# EAGLE design noch10.rev2 (EAGLE 5.10)
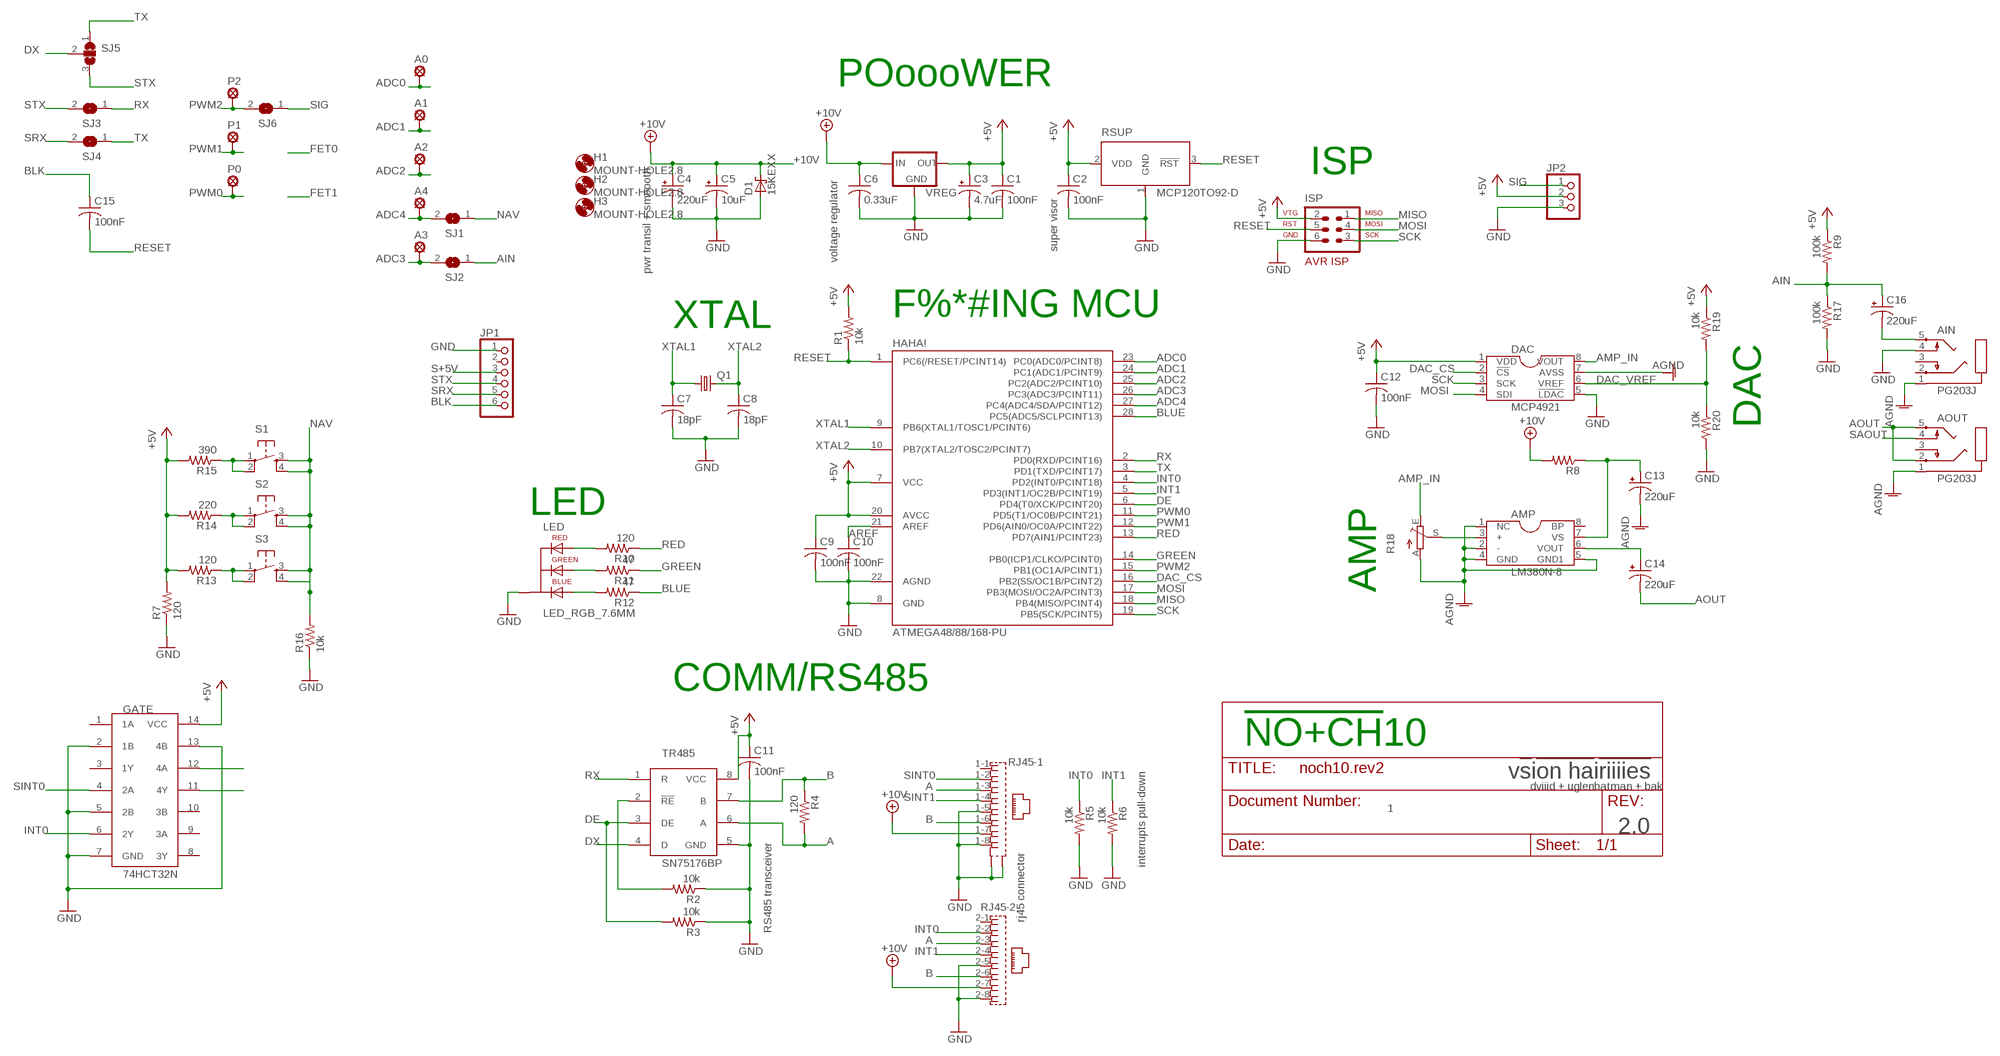
[diagram p0: schematic, sheet 1]

## Parts
A0  MCS10B  [MCS10B]
A1  MCS10B  [MCS10B]
A2  MCS10B  [MCS10B]
A3  MCS10B  [MCS10B]
A4  MCS10B  [MCS10B]
AIN  PG203J  [PG203J]
AMP  LM380N-8  [DIL08]
AOUT  PG203J  [PG203J]
C1  100nF  C-US025-025X050  [C025-025X050]
C2  100nF  C-US025-025X050  [C025-025X050]
C3  4.7uF  CPOL-USE2.5-5  [E2,5-5]
C4  220uF  CPOL-USE2.5-6  [E2,5-6]
C5  10uF  CPOL-USE2.5-5  [E2,5-5]
C6  0.33uF  C-US025-025X050  [C025-025X050]
C7  18pF  C-US025-025X050  [C025-025X050]
C8  18pF  C-US025-025X050  [C025-025X050]
C9  100nF  C-US025-025X050  [C025-025X050]
C10  100nF  C-US025-025X050  [C025-025X050]
C11  100nF  C-US025-025X050  [C025-025X050]
C12  100nF  C-US025-025X050  [C025-025X050]
C13  220uF  CPOL-USE2.5-6  [E2,5-6]
C14  220uF  CPOL-USE2.5-6  [E2,5-6]
C15  100nF  C-US025-025X050  [C025-025X050]
C16  220uF  CPOL-USE2.5-6  [E2,5-6]
D1  15KEXX  [CB429-17]
DAC  MCP4921  [DIL08]
GATE  74HCT32N  [DIL14]
H1  MOUNT-HOLE2.8  [2,8]
H2  MOUNT-HOLE2.8  [2,8]
H3  MOUNT-HOLE2.8  [2,8]
HAHA!  ATMEGA48/88/168-PU  [DIL28-3]
ISP  AVR-ISP-6  [AVR-ISP-6]
JP1  PINHD-1X6  [1X06]
JP2  PINHD-1X3  [1X03]
LED  LED_RGB_7.6MM  [LED_TH_7.6MM]
P0  MCS10B  [MCS10B]
P1  MCS10B  [MCS10B]
P2  MCS10B  [MCS10B]
Q1  CRYSTALHC49S  [HC49/S]
R1  10k  R-US_0204/7  [0204/7]
R2  10k  R-US_0204/7  [0204/7]
R3  10k  R-US_0204/7  [0204/7]
R4  120  R-US_0204/7  [0204/7]
R5  10k  R-US_0204/7  [0204/7]
R6  10k  R-US_0204/7  [0204/7]
R7  120  R-US_0204/7  [0204/7]
R8  R-US_0204/7  [0204/7]
R9  100k  R-US_0204/7  [0204/7]
R10  120  R-US_0204/7  [0204/7]
R11  47  R-US_0204/7  [0204/7]
R12  47  R-US_0204/7  [0204/7]
R13  120  R-US_0204/7  [0204/7]
R14  220  R-US_0204/7  [0204/7]
R15  390  R-US_0204/7  [0204/7]
R16  10k  R-US_0204/7  [0204/7]
R17  100k  R-US_0204/7  [0204/7]
R18  TRIM_EU-B64Y  [B64Y]
R19  10k  R-US_0204/7  [0204/7]
R20  10k  R-US_0204/7  [0204/7]
RJ45  557570-1  [557570-1]
RSUP  MCP120TO92-D  [TO92]
S1  TAC_SWITCHPTH  [TACTILE-PTH]
S2  TAC_SWITCHPTH  [TACTILE-PTH]
S3  TAC_SWITCHPTH  [TACTILE-PTH]
SJ1  SJ  [SJ]
SJ2  SJ  [SJ]
SJ3  SJ  [SJ]
SJ4  SJ  [SJ]
SJ5  SJ2W  [SJ_2]
SJ6  SJ  [SJ]
TR485  SN75176BP  [DIP08]
VREG  78XXL  [78XXL]

## Nets
+5V: C1.1 C2.1 C3.+ C9.1 C11.1 C12.1 DAC.1(VDD) GATE.14(VCC) HAHA!.7(VCC) HAHA!.20(AVCC) ISP.2 JP2.2 R1.2 R7.2 R9.1 R13.2 R14.2 R15.2 R19.1 RSUP.2(VDD) TR485.8(VCC) VREG.OUT
+10V: C4.+ C5.+ C6.1 D1.C R8.2 RJ45.1-7 RJ45.2-7 VREG.IN
A: R4.2 RJ45.1-3 RJ45.2-3 TR485.6(A)
ADC0: A0.MP HAHA!.23(PC0(ADC0/PCINT8))
ADC1: A1.MP HAHA!.24(PC1(ADC1/PCINT9))
ADC2: A2.MP HAHA!.25(PC2(ADC2/PCINT10))
ADC3: A3.MP HAHA!.26(PC3(ADC3/PCINT11)) SJ2.2
ADC4: A4.MP HAHA!.27(PC4(ADC4/SDA/PCINT12)) SJ1.2
AGND: AIN.1 AMP.1(NC) AMP.2(-) AMP.4(GND) AMP.5(GND1) AOUT.1 C13.- DAC.7(AVSS) R18.A
AIN: C16.+ R9.2 R17.1 SJ2.1
AMP_IN: DAC.8(VOUT) R18.E
AOUT: AOUT.2 AOUT.5 C14.-
AREF: C10.1 HAHA!.21(AREF)
B: R4.1 RJ45.1-6 RJ45.2-6 TR485.7(B)
BLK: C15.1 JP1.6
BLUE: HAHA!.28(PC5(ADC5/SCLPCINT13)) R12.1
DAC_CS: DAC.2(!CS) HAHA!.16(PB2(SS/OC1B/PCINT2))
DAC_VREF: DAC.6(VREF) R19.2 R20.1
DE: HAHA!.6(PD4(T0/XCK/PCINT20)) R3.2 TR485.3(DE)
DX: SJ5.2 TR485.4(D)
GND: AIN.4 C1.2 C2.2 C3.- C4.- C5.- C6.2 C7.2 C8.2 C9.2 C10.2 C11.2 C12.2 D1.A DAC.5(!LDAC) GATE.2(1B) GATE.5(2B) GATE.7(GND) GATE.13(4B) HAHA!.8(GND) HAHA!.22(AGND) ISP.6 JP1.1 JP2.3 LED.4(C) R2.1 R3.1 R5.2 R6.2 R7.1 R16.1 R17.2 R20.2 RJ45.1-5 RJ45.1-8 RJ45.2-5 RJ45.2-8 RJ45.G1(-1:S2) RJ45.G3(-1:S1) RSUP.1(GND) TR485.5(GND) VREG.GND
GREEN: HAHA!.14(PB0(ICP1/CLKO/PCINT0)) R11.1
INT0: GATE.6(2Y) HAHA!.4(PD2(INT0/PCINT18)) R5.1 RJ45.2-2
INT1: GATE.11(4Y) HAHA!.5(PD3(INT1/OC2B/PCINT19)) R6.1 RJ45.2-4
MISO: HAHA!.18(PB4(MISO/PCINT4)) ISP.1
MOSI: DAC.4(SDI) HAHA!.17(PB3(MOSI/OC2A/PCINT3)) ISP.4
N$1: LED.3(A) R10.2
N$2: AMP.7(VS) C13.+ R8.1
N$3: R2.2 TR485.2(!RE)
N$4: AMP.3(+) R18.S
N$5: AMP.6(VOUT) C14.+
N$6: LED.1(A1) R11.2
N$7: LED.2(A2) R12.2
N$8: AIN.5 C16.-
N$9: R13.1 S3.1 S3.2
N$10: R14.1 S2.1 S2.2
N$11: R15.1 S1.1 S1.2
NAV: R16.2 S1.3 S1.4 S2.3 S2.4 S3.3 S3.4 SJ1.1
PWM0: HAHA!.11(PD5(T1/OC0B/PCINT21)) P0.MP
PWM1: HAHA!.12(PD6(AIN0/OC0A/PCINT22)) P1.MP
PWM2: HAHA!.15(PB1(OC1A/PCINT1)) P2.MP SJ6.2
RED: HAHA!.13(PD7(AIN1/PCINT23)) R10.1
RESET: C15.2 HAHA!.1(PC6(/RESET/PCINT14)) ISP.5 R1.1 RSUP.3(!RST)
RX: HAHA!.2(PD0(RXD/PCINT16)) SJ3.1 TR485.1(R)
S+5V: JP1.3
SAOUT: AOUT.4
SCK: DAC.3(SCK) HAHA!.19(PB5(SCK/PCINT5)) ISP.3
SIG: JP2.1 SJ6.1
SINT0: GATE.4(2A) RJ45.1-2
SINT1: GATE.12(4A) RJ45.1-4
SRX: JP1.5 SJ4.2
STX: JP1.4 SJ3.2 SJ5.3
TX: HAHA!.3(PD1(TXD/PCINT17)) SJ4.1 SJ5.1
XTAL1: C7.1 HAHA!.9(PB6(XTAL1/TOSC1/PCINT6)) Q1.1
XTAL2: C8.1 HAHA!.10(PB7(XTAL2/TOSC2/PCINT7)) Q1.2
Unconnected: AIN.2 AIN.3 AMP.8(BP) AOUT.3 GATE.1(1A) GATE.3(1Y) GATE.8(3Y) GATE.9(3A) GATE.10(3B) JP1.2 RJ45.1-1 RJ45.2-1

## Notes on the sheet
- POoooWER
- ISP
- super visor
- voltage regulator
- pwr transil + smoooth
- XTAL | F%*#ING MCU
- DAC
- LED
- AMP
- COMM/RS485
- !NO+CH!10
- v!s!i!on ha!i!riiiies
- dviiid + uglenbatman + bak
- 1
- 2.0
- interrupts pull-down
- rj45 connector
- RS485 transceiver

## Library data of the parts
A0 A1-A4 P0 P1 P2 = solpad:MCS10B: SOLDER PAD MC S1, distributor Buerklin, 15F505
AIN AOUT = con-hirschmann:PG203J: MIC/HEADPHONE JACK KS-S stereo microphone/headphone jack PG203JN (Schukat)
AMP = dviiid:LM380N-8: The LM380 is a power audio amplifier for consumer applications.
C1 C2 C6-C12 C15 = rcl:C-US: CAPACITOR, American symbol
C3-C5 C13 C14 C16 = rcl:CPOL-US: POLARIZED CAPACITOR, American symbol
D1 = diode:15KEXX: DIODE
DAC = dviiid:MCP4921
GATE = dviiid:74HCT32N
H1-H3 = holes:MOUNT-HOLE: MOUNTING HOLE with drill center marker
HAHA! = atmega8:ATMEGA48/88/168-PU
ISP = atmel-1:AVR-ISP-6: AVR ISP-6 Serial Programming Header
JP1 = pinhead:PINHD-1X6: PIN HEADER
JP2 = pinhead:PINHD-1X3: PIN HEADER
LED = dviiid:LED_RGB_7.6MM
Q1 = crystal:CRYSTAL: CRYSTAL
R1-R17 R19 R20 = rcl:R-US_: RESISTOR, American symbol
R18 = pot:TRIM_EU-: POTENTIOMETER
RJ45 = con-amp:557570-1: AMP connector
RSUP = dviiid:MCP120
S1-S3 = SparkFun:TAC_SWITCH: Momentary Switch Button commonly used for reset or general input. Spark Fun Electronics SKU : COM-00097
SJ1-SJ4 SJ6 = jumper:SJ: SMD solder JUMPER
SJ5 = jumper:SJ2W: SMD solder JUMPER
TR485 = dviiid:SN75176BP: The SN75176B and SN65176B are differential bus transceivers RS485/RS422.
VREG = v-reg:78XXL: VOLTAGE REGULATOR

## Board
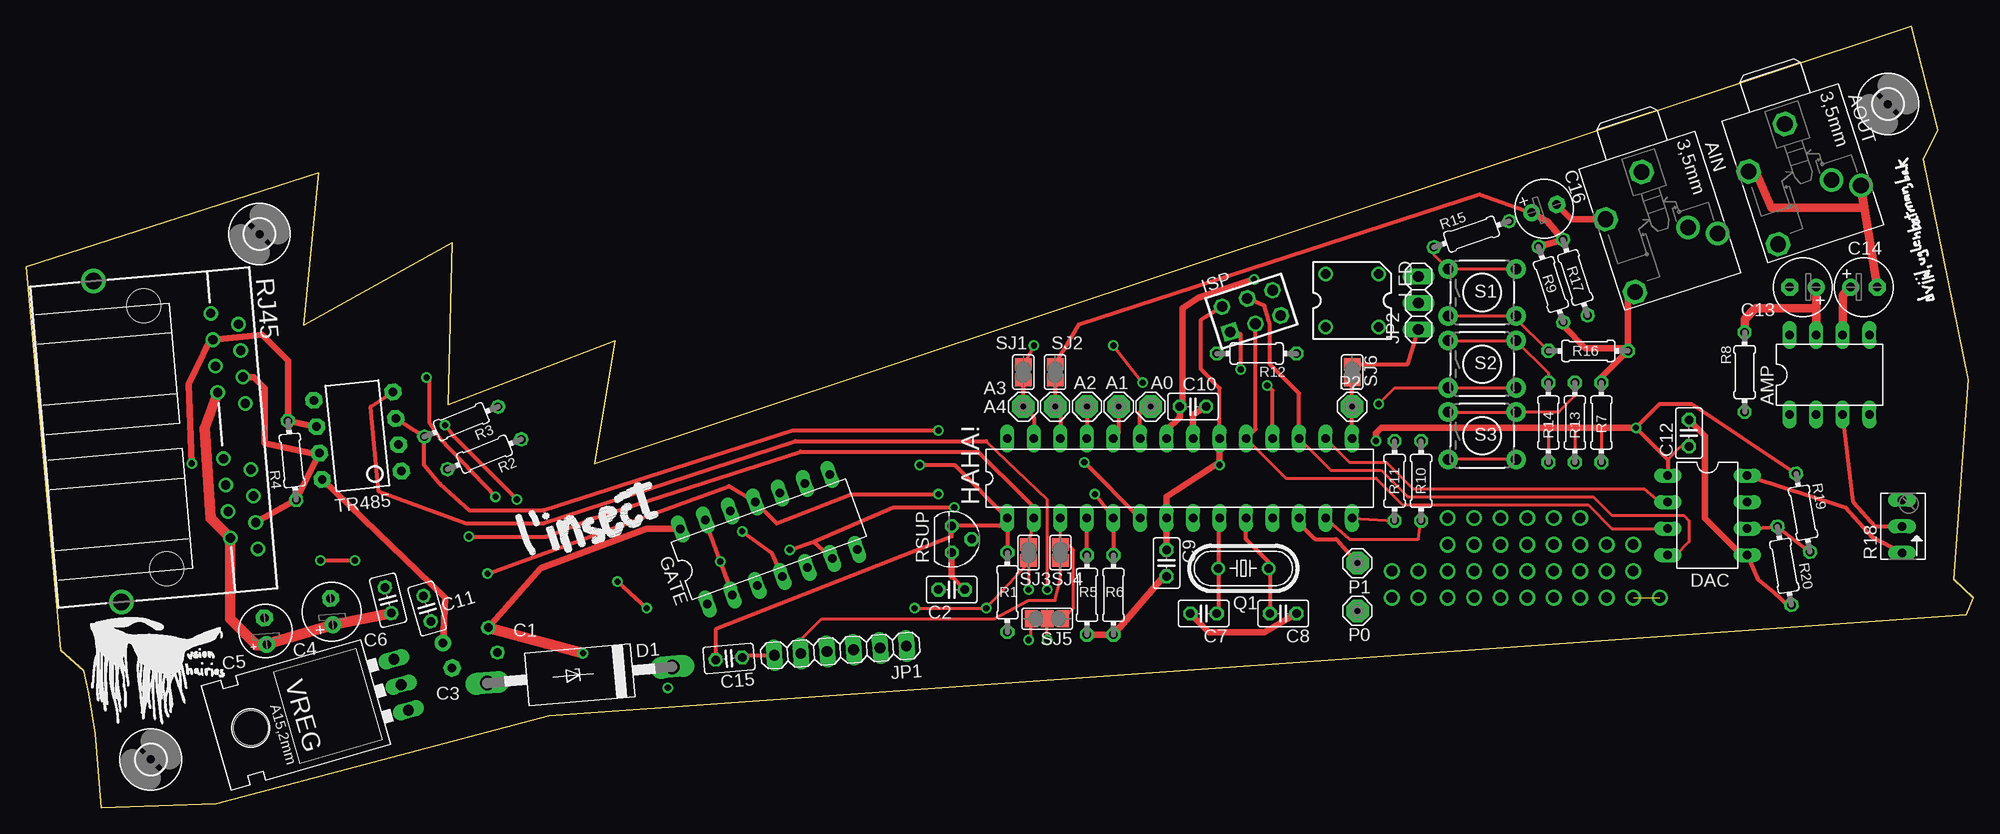
[diagram p1: board, top side]
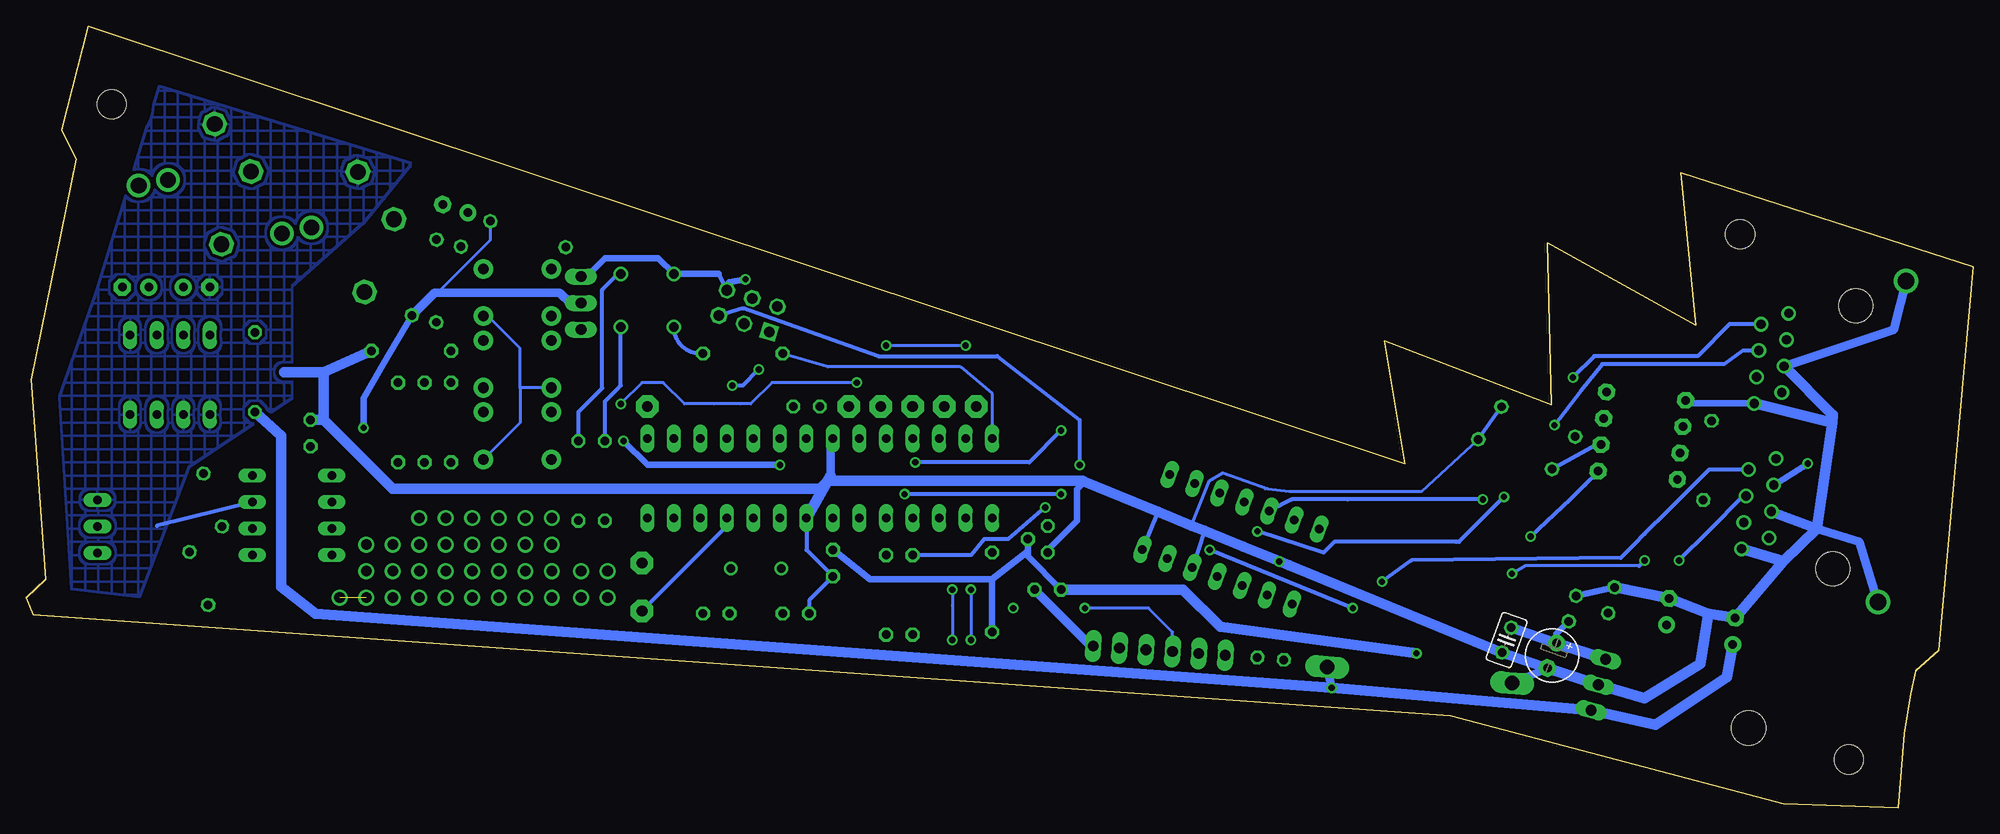
[diagram p2: board, bottom side, seen from below]

Size 186.5 x 74.84 mm. Coordinates in mm from the lower left corner, seen from the top.
Copper layers (1*16): Top 0.035mm / dielectric 1.5mm / Bottom 0.035mm
Design rules "default *": minimum track width 8mil, minimum drill 0.3mm, track to track 0.15mm, track to pad 0.15mm, pad to pad 0.15mm, via to via 0.15mm, smd to smd 0.15mm, copper to edge 40mil, drill to drill 40mil, minimum pad ring 10mil, minimum via ring 8mil, stop-mask expansion 4mil, vias tented up to drill 0mil, thermal gap 10mil

### Footprints (pad centres in the part's own frame; a part is rotated, then mirrored left to right if it is on the bottom)
MCS10B = drill 1.016 pad 2.159 octagon: MP 0,0
PG203J = drill 1.499 octagon: 1 -5.004,-0.203; 4 5.74,-4.369; 5 -1.753,-4.902 | drill 1.499 round: 2 2.845,4.902; 3 1.448,2.388
DIL08 = drill 0.813 long: 1 -3.81,-3.81; 2 -1.27,-3.81; 3 1.27,-3.81; 4 3.81,-3.81; 5 3.81,3.81; 6 1.27,3.81; 7 -1.27,3.81; 8 -3.81,3.81
C025-025X050 = drill 0.813 octagon: 1 -1.27,0; 2 1.27,0
E2,5-5 = drill 0.813 pad 1.6 round: + -1.27,0 | drill 0.813 pad 1.6 octagon: - 1.27,0
E2,5-6 = drill 0.813 pad 1.6 round: + -1.27,0 | drill 0.813 pad 1.6 octagon: - 1.27,0
CB429-17 = drill 1.397 long: A 8.89,0; C -8.89,0
DIL14 = drill 0.813 long: 1 -7.62,-3.81; 2 -5.08,-3.81; 3 -2.54,-3.81; 4 0,-3.81; 5 2.54,-3.81; 6 5.08,-3.81; 7 7.62,-3.81; 8 7.62,3.81; 9 5.08,3.81; 10 2.54,3.81; 11 0,3.81; 12 -2.54,3.81; 13 -5.08,3.81; 14 -7.62,3.81
2,8 = hole 2.8: 0,0
DIL28-3 = drill 0.813 long: 1 -16.51,-3.81; 2 -13.97,-3.81; 3 -11.43,-3.81; 4 -8.89,-3.81; 5 -6.35,-3.81; 6 -3.81,-3.81; 7 -1.27,-3.81; 8 1.27,-3.81; 9 3.81,-3.81; 10 6.35,-3.81; 11 8.89,-3.81; 12 11.43,-3.81; 13 13.97,-3.81; 14 16.51,-3.81; 15 16.51,3.81; 16 13.97,3.81; 17 11.43,3.81; 18 8.89,3.81; 19 6.35,3.81; 20 3.81,3.81; 21 1.27,3.81; 22 -1.27,3.81; 23 -3.81,3.81; 24 -6.35,3.81; 25 -8.89,3.81; 26 -11.43,3.81; 27 -13.97,3.81; 28 -16.51,3.81
AVR-ISP-6 = drill 1.016 square: 1 -2.54,-1.27 | drill 1.016 octagon: 2 -2.54,1.27; 3 0,-1.27; 4 0,1.27; 5 2.54,-1.27; 6 2.54,1.27
1X06 = drill 1.016 long: 1 -6.35,0; 2 -3.81,0; 3 -1.27,0; 4 1.27,0; 5 3.81,0; 6 6.35,0
1X03 = drill 1.016 long: 1 -2.54,0; 2 0,0; 3 2.54,0
LED_TH_7.6MM = drill 0.9 pad 1.422 round: 1 -2.54,2.54; 2 2.54,2.54; 3 -2.54,-2.54; 4 2.54,-2.54
HC49/S = drill 0.813 round: 1 -2.413,0; 2 2.413,0
0204/7 = drill 0.813 octagon: 1 -3.81,0; 2 3.81,0
B64Y = drill 0.813 long: A 2.54,0; E -2.54,0; S 0,0
557570-1 = drill 0.889 round: 1-1 -11.43,6.35; 1-2 -10.16,8.89; 1-3 -8.89,6.35; 1-4 -7.62,8.89; 1-5 -6.35,6.35; 1-6 -5.08,8.89; 1-7 -3.81,6.35; 1-8 -2.54,8.89; 2-1 2.54,6.35; 2-2 3.81,8.89; 2-3 5.08,6.35; 2-4 6.35,8.89; 2-5 7.62,6.35; 2-6 8.89,8.89; 2-7 10.16,6.35; 2-8 11.43,8.89 | drill 1.575 pad 2.184 round: G1 -15.494,-4.572; G3 15.367,-4.572 | hole 3.251: -12.7,0; 12.573,0
TO92 = drill 0.813 octagon: 1 1.27,0; 2 0,1.905; 3 -1.27,0
TACTILE-PTH = drill 1.016 pad 1.88 round: 1 -3.251,2.261; 2 3.251,2.261; 3 -3.251,-2.261; 4 3.251,-2.261
SJ = smd 1.168 x 1.6: 1 -0.762,0; 2 0.762,0
SJ_2 = smd 1.168 x 1.6: 1 -1.524,0; 2 0,0; 3 1.524,0
DIP08 = drill 0.813 pad 1.6 octagon: 1 -3.81,-3.81; 2 -1.27,-3.81; 3 1.27,-3.81; 4 3.81,-3.81; 5 3.81,3.81; 6 1.27,3.81; 7 -1.27,3.81; 8 -3.81,3.81
78XXL = drill 1.016 long: GND 0,-3.81; IN -2.54,-3.81; OUT 2.54,-3.81 | hole 3.302: 0,11.176

### Placement (x,y rotation side)
A0  107.7,38.41 0 top
A1  104.65,38.41 0 top
A2  101.6,38.41 0 top
A3  98.55,38.41 0 top
A4  95.5,38.41 0 top
AIN  156.46,56.19 288 top
AMP  172.72,41.46 0 top
AOUT  170.18,60.76 288 top
C1  44.7,16.06 250 bottom
C2  88.65,20.88 0 top
C3  40.36,14.57 250 bottom
C4  29.28,18.78 95 top
C5  22.93,16.91 95 top
C6  34.67,19.87 104 top
C7  112.78,18.6 180 top
C8  120.4,18.6 0 top
C9  109.22,23.42 270 top
C10  111.76,38.41 180 top
C11  38.4,19.07 106 top
C12  159.26,35.87 90 top
C13  170.18,49.84 180 top
C14  176.02,49.84 0 top
C15  67.31,14.28 185 top
C16  145.39,57.37 18 top
D1  53.03,12.72 185 top
DAC  161.04,27.99 270 top
GATE  71.12,25.71 20 top
H1  22.35,54.92 0 top
H2  178.31,67.36 0 top
H3  11.94,4.63 0 top
HAHA!  110.49,31.55 0 top
ISP  117.35,47.55 18 top
JP1  77.98,15.04 184 top
JP2  133.35,48.31 90 top
LED  127,48.57 180 top
P0  127.51,18.85 180 top
P1  127.51,23.42 180 top
P2  127,38.41 0 top
Q1  116.59,22.91 0 top
R1  93.98,20.63 270 top
R2  43.9,33.85 202 top
R3  41.67,36.97 202 top
R4  25.48,33.26 96 top
R5  101.6,20.37 270 top
R6  104.14,20.37 270 top
R7  150.88,36.88 270 top
R8  164.59,41.71 270 top
R9  148.37,50.77 108 top
R10  133.6,31.3 90 top
R11  131.06,31.3 90 top
R12  117.86,43.49 0 top
R13  148.34,36.88 270 top
R14  145.8,36.88 270 top
R15  138.43,54.92 19 top
R16  149.61,43.74 180 top
R17  146.03,50.11 288 top
R18  179.68,26.94 90 top
R19  170.18,28.25 280 top
R20  168.4,23.17 280 top
RJ45  12.36,35.4 275 top
RSUP  88.65,25.71 270 top
S1  139.45,49.33 0 top
S2  139.45,42.47 0 top
S3  139.45,35.61 0 top
SJ1  95.5,41.71 270 top
SJ2  98.55,41.71 270 top
SJ3  96.01,24.44 270 top
SJ4  99.06,24.44 270 top
SJ5  97.79,18.09 180 top
SJ6  127,41.71 270 top
TR485  31.75,35.62 96 top
U$1  [OUTLINE01]  2.54,-0.2 0 top
VREG  32.26,10.72 106 top

### Tracks (layer width: path | path; a pad name or v marks a point on that pad's centre or on a via)
+5V  (via drill 0.6)
  Top 0.305: R13.2 148.34,36.12 148.59,36.38 | 150.88,36.38 R7.2 | R14.2 145.8,36.12 146.05,36.38 | C12.1 158.5,34.6 157.23,33.33
  Top 0.406: ISP.2 112.52,46.72 112.52,41.96 114.3,40.19 HAHA!.20 | DAC.1 157.23,33.33 v154.18,36.38 156.46,38.66 159.51,38.66 R19.1
  Top 0.61: C9.1 HAHA!.7 109.22,29.77 114.3,33.07 HAHA!.20 v114.3,32.82 | GATE.14 62.61,26.72 59.44,26.72 49.28,22.91 C1.1 | TR485.8 40.13,20.12 C3.+ | v129.29,35.11 129.29,35.87 129.79,36.38 146.05,36.38 148.59,36.38 150.88,36.38 v154.18,36.38
  Top 1.016: v53.34,14.79 C1.1
  Bottom 0.305: R15.2 142.03,54.36 147.07,49.33
  Bottom 0.61: C9.1 105.66,21.9 93.98,21.9 | 93.98,21.9 90.55,24.57 RSUP.2 90.55,24.06 C2.1 | 93.98,21.9 R1.2 | v154.18,36.38 154.18,39.21 152.29,42.45 R9.1 | C3.+ 39.93,16.66 C11.1 | v114.3,32.82 127,32.82 v129.29,35.11
  Bottom 0.813: JP2.2 134.37,48.31 135.38,49.33 147.07,49.33 147.37,49.33 R9.1
  Bottom 1.016: C1.1 C3.+ VREG.OUT | v53.34,14.79 72.14,17.33 75.69,20.88 C2.1
+10V  (via drill 0.6)
  Top 1.016: RJ45.1-7 17.1,36.33 17.68,27.73 RJ45.2-7 19.57,18.08 22.1,15.55 22.95,15.55 C5.+ C4.+ C6.1
  Bottom 0.813: v61.47,11.48 D1.C
  Bottom 1.016: R8.2 162.05,35.61 162.05,21.14 158.75,18.6 v61.47,11.48 VREG.IN 30.48,7.93 23.62,12.5 C5.+
A  (via drill 0.6)
  Top 0.61: v15.86,32.95 15.58,40.53 17.65,44.79 RJ45.1-3 22.61,45.27 25.08,42.79 R4.2 27.67,36.49 TR485.6
  Bottom 0.61: RJ45.2-3 v15.86,32.95
ADC0
  Top 0.406: HAHA!.23 106.68,37.9 A0.MP
ADC1
  Top 0.406: HAHA!.24 104.65,35.87 A1.MP
ADC2
  Top 0.406: A2.MP HAHA!.25
ADC3
  Top 0.406: HAHA!.26 99.06,37.9 A3.MP SJ2.2
ADC4
  Top 0.406: HAHA!.27 96.52,37.39 A4.MP SJ1.2
AGND
  Bottom 0.406: DAC.7 173.99,26.98
  pour Bottom (isolate 0.3, hatched): 149.61,61.78 173.74,69.14 179.83,49.33 183.33,39.38 182.18,20.91 175.63,20.16 170.88,32.59 161.04,39.17 161.04,49.84 154.18,55.93 149.61,61.52 149.86,61.78
AIN
  Top 0.406: SJ2.1 100.08,45.01 100.84,46.28 139.19,58.73 C16.+
  Top 0.61: C16.+ 145.7,56.14 R9.2 R17.1
AMP_IN
  Top 0.406: DAC.8 174.24,28.76 176.78,25.96 R18.E
AOUT
  Top 0.813: C14.- AOUT.2 176.02,57.46 167.13,57.46 165.61,61.01 AOUT.5
AREF
  Top 0.61: C10.1 111.76,37.65 HAHA!.21
B
  Top 0.61: 28.02,33.82 R4.1 RJ45.2-6 | 28.02,33.82 TR485.7 | RJ45.1-6 21.81,41.24 22.86,40.19 22.86,34.91 28.02,33.82
BLK
  Top 0.406: JP1.6 68.58,14.6 C15.1
BLUE
  Bottom 0.305: HAHA!.28 93.98,39.68 97.03,42.22 109.73,42.22 R12.1
DAC_CS
  Top 0.305: DAC.2 156.46,29.26 154.94,30.53 132.84,30.53 130.3,33.07 126.75,33.07 HAHA!.16
DAC_VREF
  Top 0.406: DAC.6 R20.1 R19.2
DE  (via drill 0.6)
  Top 0.406: TR485.3 R3.2 38.14,32.78 39.62,31.04 42.42,28.5 49.53,28.5 73.41,36.12 v87.38,36.12 | v101.35,33.07 HAHA!.6
  Bottom 0.406: v101.35,33.07 90.42,33.07 v87.38,36.12
DX  (via drill 0.6)
  Top 0.305: 91.95,35.11 97.79,29.52 v97.79,20.88 | v97.79,16.06 SJ5.2
  Top 0.406: TR485.4 33.02,38.41 33.78,30.28 42.16,27.23 49.53,27.23 73.66,35.11 91.95,35.11
  Bottom 0.305: v97.79,20.88 97.79,19.36 v97.79,16.06
GND  (via drill 0.6)  (1 unrouted)
  Top 0.305: RJ45.G3 9.14,19.61
  Top 0.406: 88.65,22.15 C2.2 | GATE.13 GATE.2 v66.48,23.59 | R20.2 168.75,19.36 167.39,20.63 165.86,21.9 DAC.5
  Top 0.61: RSUP.1 88.65,22.15 | C9.2 108.97,22.15 R6.2 R5.2 | C7.2 113.28,16.82 118.62,16.82 C8.2 | HAHA!.22 109.22,36.12 110.49,37.39 C10.2 | R17.2 147.21,46.14 149.35,44 153.16,44 R16.1 | R7.1 150.88,41.2 R16.1 | R16.1 153.42,48.71 AIN.4 | v117.6,50.6 112.27,48.82 110.74,47.81 110.74,38.66 | DAC.5 164.34,24.18 160.78,27.74 160.78,35.61 C12.2
  Bottom 0.305: R2.1 52.83,30.28 65.53,30.28 67.56,30.53 | 67.56,30.53 67.82,30.53 | 69.93,25 74.93,26.98 | 67.56,30.53 71.88,32.06 73.15,31.3 74.87,27.01
  Bottom 0.406: 78.09,28.33 GATE.7 | 73.64,26.51 GATE.5 | ISP.6 120.17,51.11 | R2.1 R3.1 | C7.2 111.51,19.87 C9.2 111.76,24.69 HAHA!.8
  Bottom 0.61: RSUP.1 88.65,24.69 85.85,27.49 85.85,30.48 85.13,31.21 | C10.2 110.74,38.66 | RJ45.1-8 26.85,38.71 TR485.5 | C6.2 C11.2 | 120.17,51.11 LED.4 125.98,52.63 131.06,52.63 132.84,50.85 JP2.3 | ISP.6 119.17,50.31 v117.6,50.6
  Bottom 0.813: JP1.1 84.52,15.48 C2.2 | HAHA!.22 109.47,35.11 109.47,31.8 109.47,31.3 | RJ45.1-5 7.62,45.77 RJ45.G1 | RJ45.G3 10.92,25.45 14.99,26.72 | C3.- D1.A
  Bottom 1.016: RJ45.1-5 13.49,37.65 13.46,37.65 13.53,36.87 | 14.99,26.72 13.53,36.87 | 18.22,23.61 C5.- 25.4,18.57 | 18.22,23.61 14.99,26.72 | 18.22,23.61 RJ45.2-8 | 14.99,26.72 RJ45.2-5 | 25.4,18.57 C4.- C6.2 | 25.4,18.57 26.16,13.77 31.5,10.47 VREG.GND C3.- C1.2 65.56,23.21 v66.48,23.59 69.93,25 73.64,26.51 74.87,27.01 78.09,28.33 85.13,31.21 85.34,31.3 109.47,31.3 | 13.53,36.87 RJ45.1-8 | HAHA!.8 109.81,31.2 | 109.81,31.2 109.47,31.8 | 157.99,37.14 C12.2 | 157.99,37.14 151.38,30.53 110.48,30.53 109.81,31.2 | 157.99,37.14 157.99,41.71 | 157.99,41.71 R16.1 | 157.99,41.71 161.8,41.71
GREEN
  Top 0.305: HAHA!.14 R11.1
INT0  (via drill 0.6)
  Top 0.406: v56.64,21.64 v59.44,19.1 | v73.15,24.69 75.44,25.45 | 75.44,25.45 GATE.6 | v88.9,28.76 83.06,28.76 75.44,25.45 | HAHA!.4 101.6,25.45 R5.1
  Bottom 0.406: RJ45.2-2 25.33,32.38 29.21,28.5 31.5,26.22 32.51,25.2 33.78,23.93 53.85,23.68 v56.64,21.64 | v59.44,19.1 v73.15,24.69 | v88.9,28.76 92.46,25.71 94.74,25.71 96.01,24.18 R5.1
INT1  (via drill 0.6)
  Top 0.406: R6.1 HAHA!.5 v102.36,30.03 | v44.2,22.41 67.31,30.79 GATE.11 71.88,27.23 78.99,30.03 v87.38,30.03 | v31.5,23.68 28.96,23.68 v28.19,23.68
  Bottom 0.305: 32,23.17 42.93,23.17 v44.2,22.41
  Bottom 0.406: RJ45.2-4 22.02,29.85 25.4,26.47 v28.19,23.68 | v87.38,30.03 v102.36,30.03 | v31.5,23.68 32,23.17
MISO  (via drill 0.6)
  Top 0.406: HAHA!.18 119.38,39.93 v118.87,40.44 | v116.33,41.96 116.33,45.31 ISP.1
  Bottom 0.406: v118.87,40.44 117.86,40.44 v116.33,41.96
MOSI
  Top 0.305: DAC.4 157.99,24.18 159.26,25.45 159.26,27.49 158.75,27.99 151.89,27.99 150.11,29.77 132.33,29.77 129.79,32.31 124.97,32.31 HAHA!.17
  Top 0.406: HAHA!.17 121.92,39.68 119.13,42.47 119.13,46.28 118.62,48.06 ISP.4
N$1
  Bottom 0.406: R10.2 133.6,37.9 131.32,40.19 131.32,49.58 129.79,51.11 LED.3
N$2
  Top 0.813: 171.45,47.81 AMP.7 | 171.45,47.81 C13.+ | R8.1 164.59,46.79 165.61,47.81 171.45,47.81
N$3
  Bottom 0.406: TR485.2 36.09,34.76 R2.2
N$4
  Top 0.406: R18.S 177.07,26.94 175.01,29.26 AMP.3
N$5
  Top 0.813: AMP.6 173.99,49.08 C14.+
N$6
  Bottom 0.406: R11.2 131.06,38.92 129.79,40.19 129.54,40.44 LED.1
N$7
  Bottom 0.406: R12.2 121.92,43.49 arc90 LED.2
N$8
  Top 0.61: AIN.5 148.01,56.34 C16.-
N$9
  Top 0.305: S3.1 S3.2 142.72,37.9 146.81,37.9 148.34,39.42 R13.1
N$10
  Top 0.305: S2.1 S2.2 145.8,41.63 R14.1
N$11
  Top 0.305: S1.2 S1.1 134.83,52.96 R15.1
N$18  (via drill 1.02)
  other vias: 148.84,27.74
N$21  (via drill 1.02)
  other vias: 148.84,20.12
N$22  (via drill 1.02)
  other vias: 148.84,22.66
N$23  (via drill 1.02)
  other vias: 148.84,25.2
N$24  (via drill 1.02)
  other vias: 146.3,27.74
N$25  (via drill 1.02)
  other vias: 153.92,25.2
N$27  (via drill 1.02)
  other vias: 146.3,20.12
N$28  (via drill 1.02)
  other vias: 146.3,22.66
N$29  (via drill 1.02)
  other vias: 146.3,25.2
N$30  (via drill 1.02)
  other vias: 143.76,27.74
N$31  (via drill 1.02)  (1 unrouted)
  other vias: 153.92,20.12 156.46,20.12
N$32  (via drill 1.02)
  other vias: 153.92,22.66
N$33  (via drill 1.02)
  other vias: 143.76,20.12
N$34  (via drill 1.02)
  other vias: 143.76,22.66
N$35  (via drill 1.02)
  other vias: 143.76,25.2
N$36  (via drill 1.02)
  other vias: 141.22,27.74
N$37  (via drill 1.02)
  other vias: 151.38,25.2
N$39  (via drill 1.02)
  other vias: 141.22,20.12
N$40  (via drill 1.02)
  other vias: 141.22,22.66
N$41  (via drill 1.02)
  other vias: 141.22,25.2
N$42  (via drill 1.02)
  other vias: 138.68,27.74
N$43  (via drill 1.02)
  other vias: 151.38,20.12
N$44  (via drill 1.02)
  other vias: 151.38,22.66
N$45  (via drill 1.02)
  other vias: 138.68,20.12
N$46  (via drill 1.02)
  other vias: 138.68,22.66
N$47  (via drill 1.02)
  other vias: 138.68,25.2
N$48  (via drill 1.02)
  other vias: 136.14,27.74
N$51  (via drill 1.02)
  other vias: 136.14,20.12
N$52  (via drill 1.02)
  other vias: 136.14,22.66
N$53  (via drill 1.02)
  other vias: 136.14,25.2
N$59  (via drill 1.02)
  other vias: 133.35,22.66
N$60  (via drill 1.02)
  other vias: 133.35,20.12
N$61  (via drill 1.02)
  other vias: 130.81,22.66
N$62  (via drill 1.02)
  other vias: 130.81,20.12
NAV  (via drill 0.6)
  Top 0.305: S1.3 S1.4 142.7,46.84 R16.2 | S2.4 S2.3 131.09,40.21 v129.54,38.66 | S3.4 S3.3 | v96.52,44.25 SJ1.1 | v104.14,44.25 v106.93,40.69
  Bottom 0.305: S1.4 142.27,47.07 139.19,44 139.19,40.19 | 139.19,40.19 139.19,36.86 S3.4 | S2.3 139.17,40.21 139.19,40.19 | v96.52,44.25 v104.14,44.25 | v106.93,40.69 115.06,40.69 117.09,38.66 118.11,38.66 120.65,38.66 123.44,38.66 125.48,40.69 127.51,40.69 v129.54,38.66
PWM0
  Bottom 0.406: HAHA!.11 119.38,26.98 P0.MP
PWM1
  Top 0.406: HAHA!.12 121.92,27.23 123.44,25.71 125.48,25.71 P1.MP
PWM2
  Top 0.406: HAHA!.15 P2.MP SJ6.2
RED
  Top 0.305: HAHA!.13 126.75,25.71 133.35,25.71 R10.1
RESET  (via drill 0.6)
  Top 0.406: HAHA!.1 R1.1 | HAHA!.1 93.22,26.98 RSUP.3 88.65,25.96 66.04,17.07 66.04,16.56 66.04,15.8 C15.2 | HAHA!.1 88.9,32.82 v85.6,32.82
  Bottom 0.406: v85.6,32.82 85.6,37.14 93.47,43.23 104.9,43.23 117.86,47.81 ISP.5
RX  (via drill 0.6)
  Top 0.305: HAHA!.2 SJ3.1
  Top 0.406: HAHA!.2 96.52,28.76 95.5,29.77 91.19,34.09 74.17,34.09 54.36,27.74 49.78,25.96 v42.42,25.96
  Bottom 0.406: v42.42,25.96 38.61,29.52 37.2,30.92 35.93,32.19 TR485.1
SCK
  Top 0.305: DAC.3 151.89,26.72 149.61,29.01 131.83,29.01 129.29,31.55 120.65,31.55 HAHA!.19
  Top 0.406: ISP.3 117.74,36.26 HAHA!.19
SIG
  Top 0.406: JP2.1 132.33,42.47 SJ6.1
SINT0  (via drill 0.6)
  Top 0.406: v44.96,29.77 39.62,35.36 38.61,36.88 38.61,40.95 v38.35,41.2 | v68.58,26.47 71.37,24.44 GATE.4
  Bottom 0.406: RJ45.1-2 23.35,46.3 26.42,43.23 36.32,43.23 v38.35,41.2 | v44.96,29.77 49.28,25.45 49.53,25.45 61.21,25.45 62.23,24.44 v68.58,26.47
SINT1  (via drill 0.6)
  Top 0.406: v40.13,36.63 40.89,35.61 v46.99,29.52
  Bottom 0.406: RJ45.1-4 22.07,43.77 23.88,42.47 35.56,42.47 37.59,39.93 v40.13,36.63 | v46.99,29.52 59.94,29.52 65.28,29.52 GATE.12
SRX
  Top 0.305: JP1.5 74.18,16.07 76.2,18.09 92.71,18.09 96.01,19.87 98.55,19.87 99.06,21.9 SJ4.2
STX  (via drill 0.6)
  Top 0.305: v85.09,19.1 v91.95,19.1 96.27,23.68 SJ3.2 96.01,23.17 v96.01,20.88 | SJ5.3 96.27,16.31 v96.01,16.06
  Bottom 0.305: JP1.4 76.71,16.82 78.99,19.1 83.31,19.1 v85.09,19.1 | v96.01,20.88 v96.01,16.06
TX
  Top 0.305: HAHA!.3 SJ4.1 99.82,25.2 100.33,24.69 100.33,19.1 SJ5.1
XTAL1
  Top 0.406: HAHA!.9 114.17,27.61 Q1.1 114.17,18.72 C7.1
XTAL2
  Top 0.406: HAHA!.10 116.84,25.71 119,23.55 Q1.2 119.13,22.79 C8.1

### Text on the board
tNames: /Users/daviid/Documents/NOCH10/vsionhairies.bmp